# Altium schematic sheet 51-2001-01-4_04 Power Module Schematic.SchDoc
size 431 x 279 mm; Organization: ORGANIZATION; Address1: ADDRESS 1; Address2: ADDRESS 2; Address3: ADDRESS 3; Address4: ADDRESS 4; Revision: -; SheetNumber: 4; SheetTotal: 4; ENG_APP_DATE: --/--/--; DSN_APP_DATE: --/--/--; CHK_APP_DATE: --/--/--
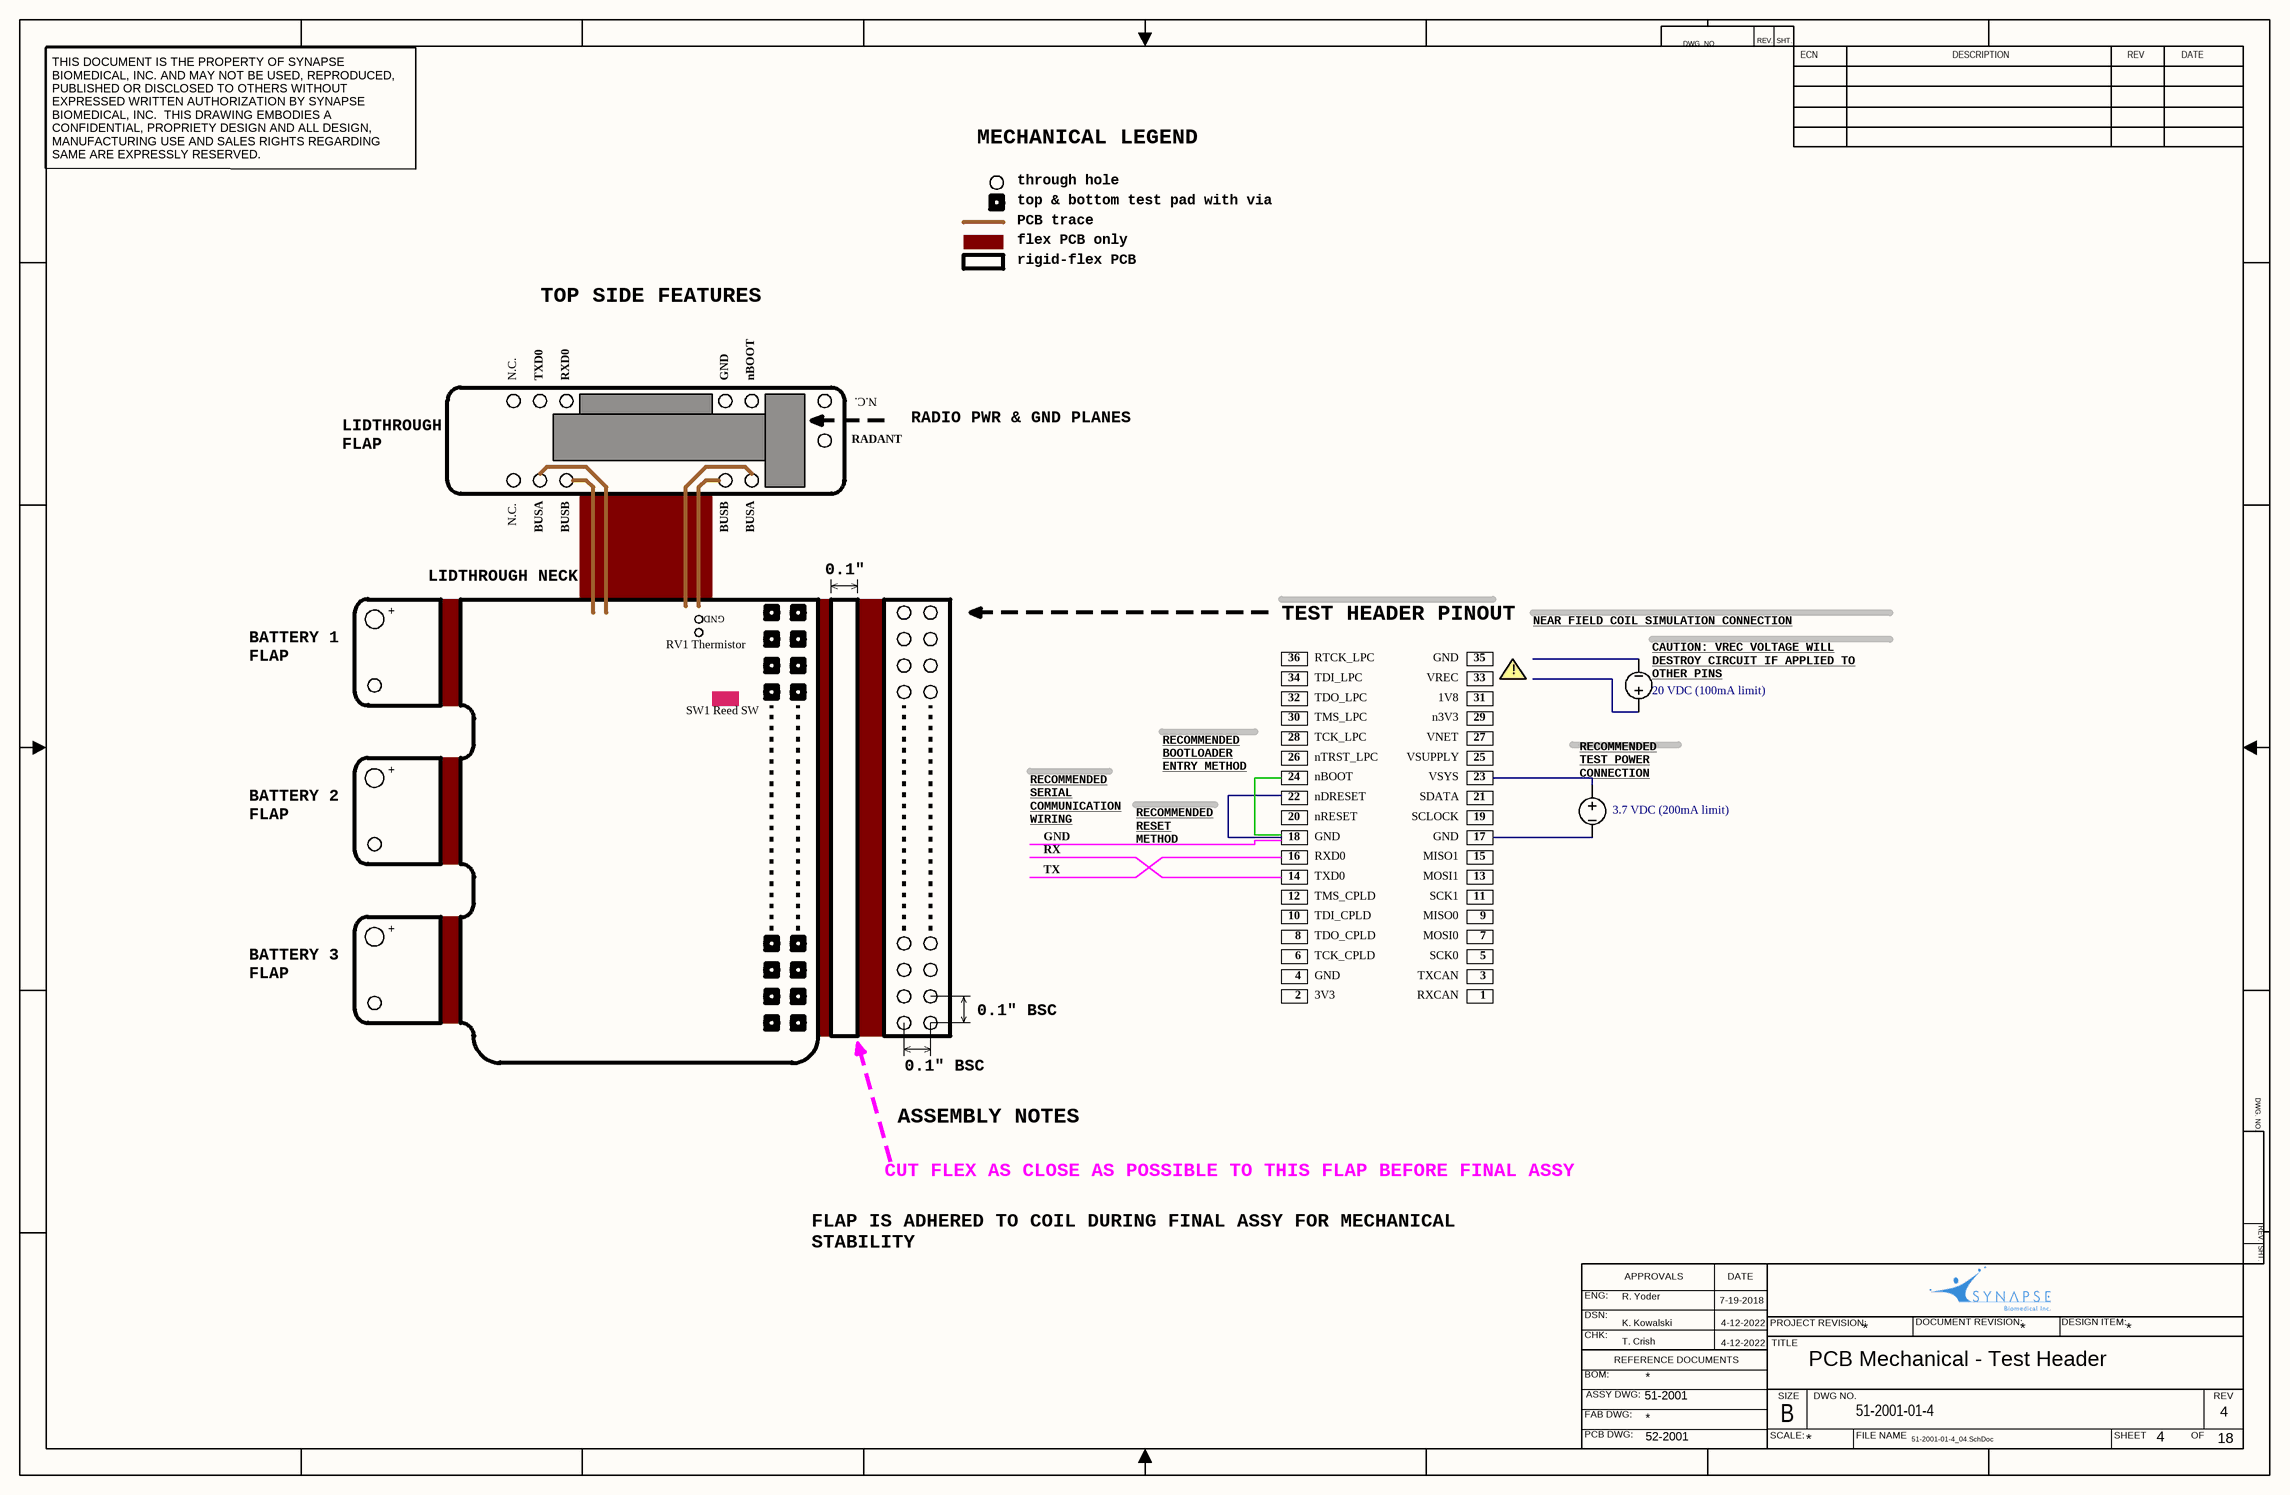
[diagram p0: 51-2001-01-4_04 Power Module Schematic.SchDoc]

## Parts
(Parts that share a designator on the sheet are numbered #1, #2 ... from top to bottom, then left to right.)
V?#1  value 20 VDC (100mA limit)  (hidden comment: VDC)  (graphical)
V?#2  value 3.7 VDC (200mA limit)  (hidden comment: VDC)  (graphical)

## Nets

Not connected (* = marked no-connect by the designer): V?#1 N P; V?#2 N P

## Notes on the sheet
- DWG. NO.
- REV.
- SHT.
- ECN
- DESCRIPTION
- REV
- DATE
- THIS DOCUMENT IS THE PROPERTY OF SYNAPSE BIOMEDICAL, INC. AND MAY NOT BE USED, REPRODUCED, PUBLISHED OR DISCLOSED TO OTHERS WITHOUT EXPRESSED WRITTEN AUTHORIZATION BY SYNAPSE BIOMEDICAL, INC.  THIS DRAWING EMBODIES A CONFIDENTIAL, PROPRIETY DESIGN AND ALL DESIGN, MANUFACTURING USE AND SALES RIGHTS REGARDING SAME ARE EXPRESSLY RESERVED.
- MECHANICAL LEGEND
- through hole
- flex PCB only
- top & bottom test pad with via
- PCB trace
- TOP SIDE FEATURES
- rigid-flex PCB
- N.C.
- TXD0
- RXD0
- GND
- nBOOT
- RADANT
- RADIO PWR & GND PLANES
- LIDTHROUGH FLAP
- BUSA
- BUSB
- 0.1"
- +
- LIDTHROUGH NECK
- TEST HEADER PINOUT
- (near V?#1) NEAR FIELD COIL SIMULATION CONNECTION
- BATTERY 1 FLAP
- RV1 Thermistor
- 32
- 34
- 36
- RTCK_LPC
- TDI_LPC
- TDO_LPC
- VREC
- 1V8
- 31
- 33
- 35
- !
- (near V?#1) CAUTION: VREC VOLTAGE WILL DESTROY CIRCUIT IF APPLIED TO OTHER PINS
- SW1 Reed SW
- RECOMMENDED BOOTLOADER ENTRY METHOD
- 26
- 28
- 30
- TMS_LPC
- TCK_LPC
- nTRST_LPC
- n3V3
- VNET
- VSUPPLY
- 25
- 27
- 29
- (near V?#2) RECOMMENDED TEST POWER CONNECTION
- BATTERY 2 FLAP
- RECOMMENDED SERIAL COMMUNICATION WIRING
- RECOMMENDED RESET METHOD
- 18
- 20
- 22
- 24
- nDRESET
- nRESET
- VSYS
- SDATA
- SCLOCK
- 17
- 19
- 21
- 23
- TX
- RX
- 12
- 14
- 16
- TMS_CPLD
- MISO1
- MOSI1
- SCK1
- 11
- 13
- 15
- 10
- 6
- 8
- TDI_CPLD
- TDO_CPLD
- TCK_CPLD
- MISO0
- MOSI0
- SCK0
- 5
- 7
- 9
- BATTERY 3 FLAP
- 0.1" BSC
- 2
- 4
- 3V3
- TXCAN
- RXCAN
- 1
- 3
- ASSEMBLY NOTES
- FLAP IS ADHERED TO COIL DURING FINAL ASSY FOR MECHANICAL STABILITY
- CUT FLEX AS CLOSE AS POSSIBLE TO THIS FLAP BEFORE FINAL ASSY
- ENG:
- R. Yoder
- APPROVALS
- 7-19-2018
- DSN:
- CHK:
- REFERENCE DOCUMENTS
- K. Kowalski
- T. Crish
- 4-12-2022
- PROJECT REVISION:
- TITLE
- PCB Mechanical - Test Header
- *
- DOCUMENT REVISION:
- DESIGN ITEM:
- BOM:
- FAB DWG:
- PCB DWG:
- ASSY DWG:
- 51-2001
- SCALE:
- SIZE
- B
- DWG NO.
- 51-2001-01-4
- FILE NAME
- SHEET
- OF
- 52-2001
- 51-2001-01-4_04.SchDoc

## Library data of the parts
V?#1 V?#2 = VDC: Voltage source DC